# EAGLE design SX-Belegt2.10 (EAGLE 7.7.0)
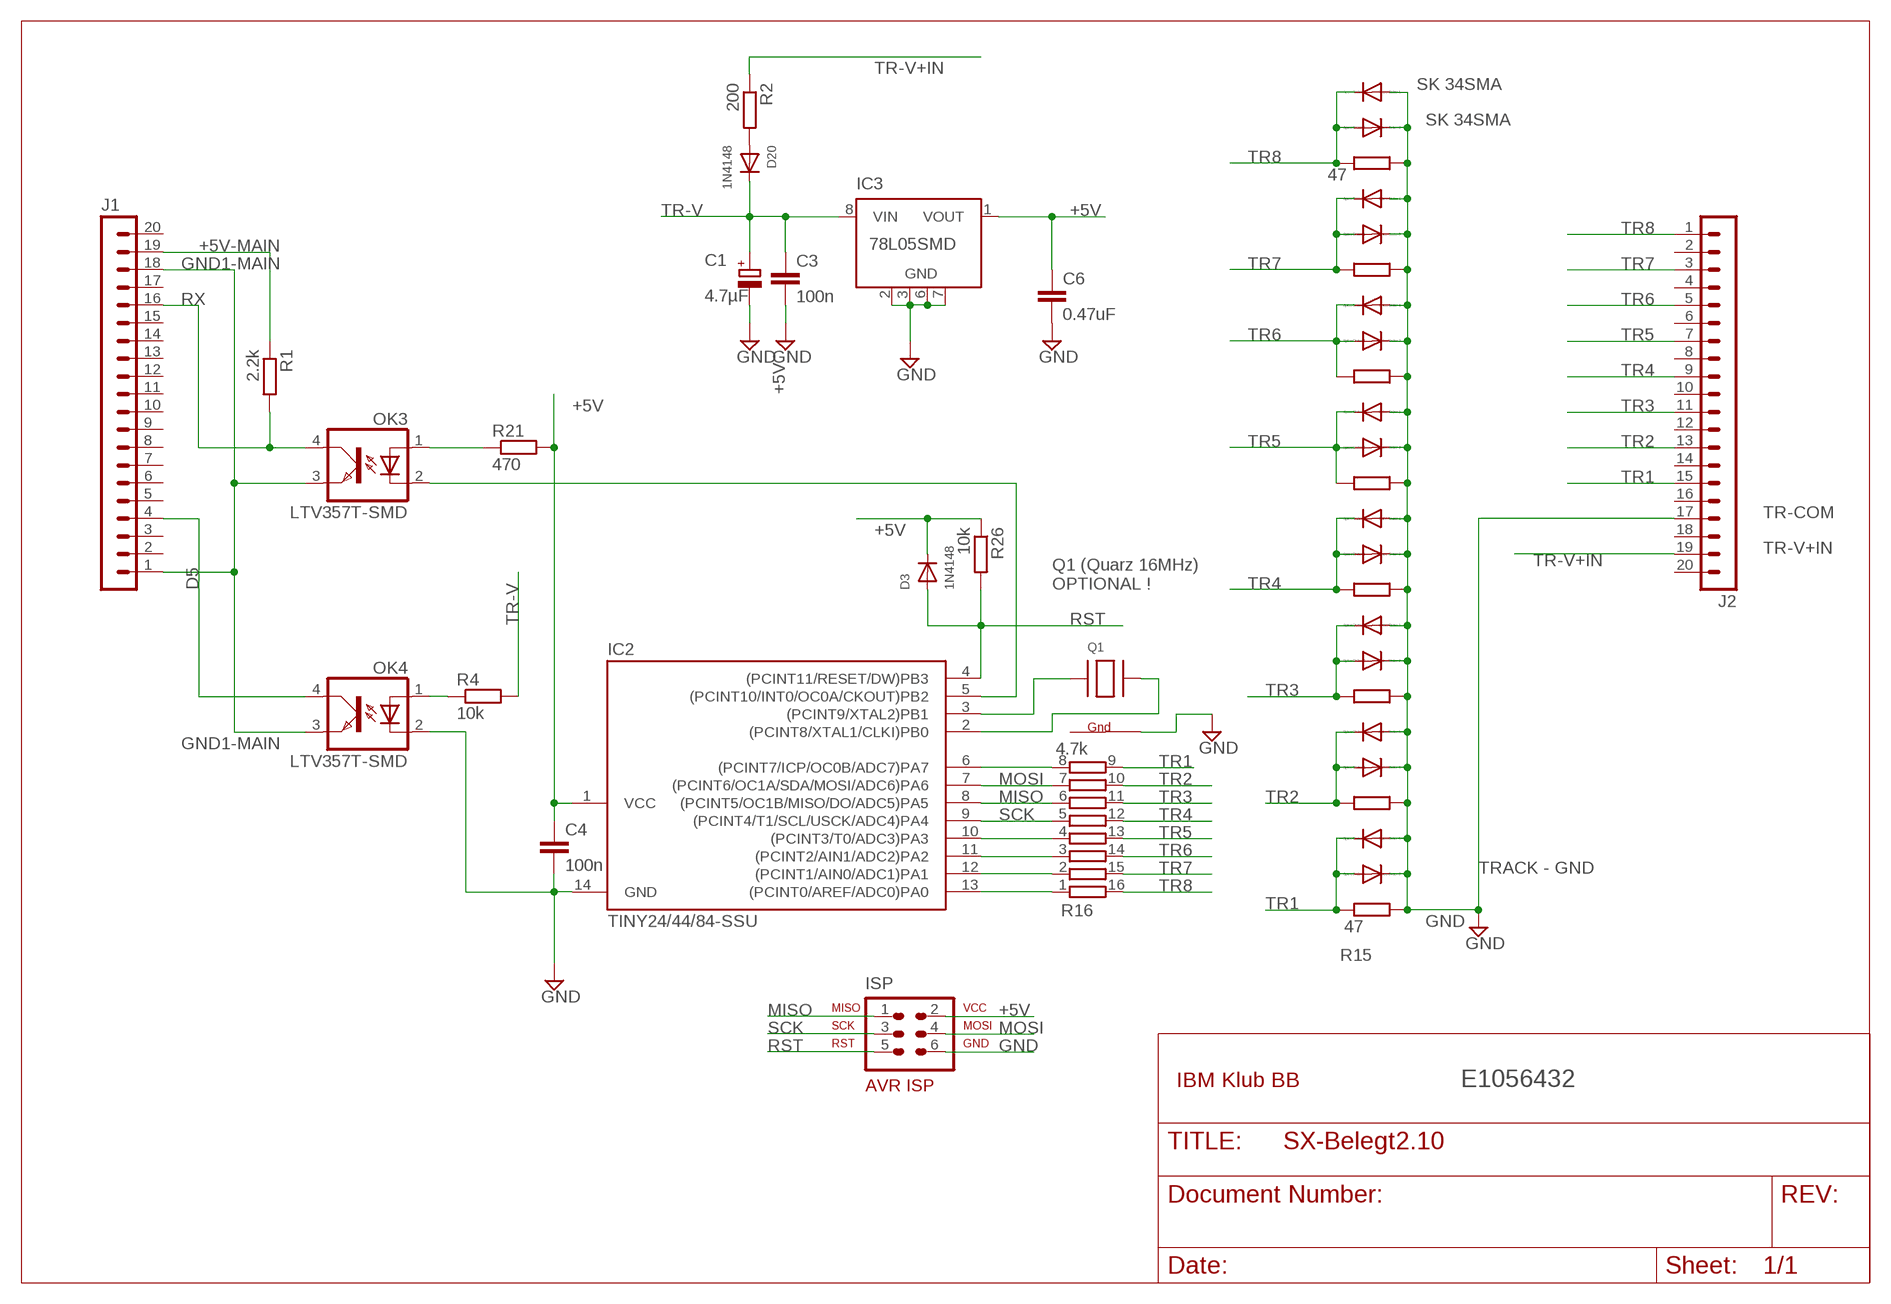
[diagram p0: schematic, sheet 1]

## Parts
C1  4.7µF  CPOL-EUSMCD  [SMC_D]
C3  100n  C-EUC0805K  [C0805K]
C4  100n  C-EUC0805K  [C0805K]
C6  0.47uF  C-EUC1206  [C1206]
D1  SK 34SMA  DIODE-DO-214AC  [DO-214AC]
D2  SK 34SMA  DIODE-DO-214AC  [DO-214AC]
D3  1N4148  DIODESOD-323F  [SOD-323F]
D4  SK 34SMA  DIODE-DO-214AC  [DO-214AC]
D5  SK 34SMA  DIODE-DO-214AC  [DO-214AC]
D6  SK 34SMA  DIODE-DO-214AC  [DO-214AC]
D7  SK 34SMA  DIODE-DO-214AC  [DO-214AC]
D9  SK 34SMA  DIODE-DO-214AC  [DO-214AC]
D10  SK 34SMA  DIODE-DO-214AC  [DO-214AC]
D11  SK 34SMA  DIODE-DO-214AC  [DO-214AC]
D12  SK 34SMA  DIODE-DO-214AC  [DO-214AC]
D13  SK 34SMA  DIODE-DO-214AC  [DO-214AC]
D15  SK 34SMA  DIODE-DO-214AC  [DO-214AC]
D16  SK 34SMA  DIODE-DO-214AC  [DO-214AC]
D17  SK 34SMA  DIODE-DO-214AC  [DO-214AC]
D18  SK 34SMA  DIODE-DO-214AC  [DO-214AC]
D19  SK 34SMA  DIODE-DO-214AC  [DO-214AC]
D20  1N4148  DIODESOD-323F  [SOD-323F]
IC2  TINY24/44/84-SSU  [SOIC14]
IC3  78L05SMD  [SO08]
ISP  AVR-ISP-2  AVR-ISP-6VERT  [AVR-ISP-6]
J1  MA20-1  [MA20-1]
J2  MA20-1  [MA20-1]
OK3  LTV357T-SMD  LTV816S  [SMD4]
OK4  LTV357T-SMD  LTV816S  [SMD4]
Q1  XTAL-4-3225  [NX3225]
R1  2.2k  R-EU_R0805W  [R0805W]
R2  200  R-EU_R0805W  [R0805W]
R4  10k  R-EU_R0805W  [R0805W]
R5  47  R-EU_M0805  [M0805]
R6  47  R-EU_M0805  [M0805]
R7  47  R-EU_M0805  [M0805]
R11  47  R-EU_M0805  [M0805]
R12  47  R-EU_M0805  [M0805]
R13  47  R-EU_M0805  [M0805]
R14  47  R-EU_M0805  [M0805]
R15  47  R-EU_M0805  [M0805]
R16  4.7k  4816P-T01  [4816P]
R21  470  R-EU_R0805W  [R0805W]
R26  10k  R-EU_R0805W  [R0805W]

## Nets
+5V: C4.1 C6.1 D3.C IC2.1(VCC) IC3.1(VOUT) ISP.2 R21.2 R26.1
+5V-MAIN: J1.19 R1.1
D5: J1.4 OK4.4(COL)
GND: C1.- C3.2 C4.2 C6.2 D1.A D2.C D4.A D5.C D6.A D7.C D9.A D10.A D11.A D12.A D13.A D15.C D16.C D17.C D18.C D19.C IC2.14(GND) IC3.2(GND) IC3.3(GND) IC3.6(GND) IC3.7(GND) ISP.6 J2.17 OK4.2(C) Q1.2(G2) R5.1 R6.1 R7.1 R11.1 R12.1 R13.1 R14.1 R15.1
GND1-MAIN: J1.1 J1.18 OK3.3(EMIT) OK4.3(EMIT)
MISO: IC2.8((PCINT5/OC1B/MISO/DO/ADC5)PA5) ISP.1 R16.6
MOSI: IC2.7((PCINT6/OC1A/SDA/MOSI/ADC6)PA6) ISP.4 R16.7
N$1: IC2.6((PCINT7/ICP/OC0B/ADC7)PA7) R16.8
N$2: D20.A R2.2
N$3: OK4.1(A) R4.1
N$5: OK3.1(A) R21.1
N$6: IC2.3((PCINT9/XTAL2)PB1) Q1.1(X1)
N$7: IC2.2((PCINT8/XTAL1/CLKI)PB0) Q1.3(X2)
N$10: IC2.13((PCINT0/AREF/ADC0)PA0) R16.1
N$14: IC2.5((PCINT10/INT0/OC0A/CKOUT)PB2) OK3.2(C)
N$15: IC2.12((PCINT1/AIN0/ADC1)PA1) R16.2
N$20: IC2.10((PCINT3/T0/ADC3)PA3) R16.4
N$27: IC2.11((PCINT2/AIN1/ADC2)PA2) R16.3
RST: D3.A IC2.4((PCINT11/RESET/DW)PB3) ISP.5 R26.2
RX: J1.16 OK3.4(COL) R1.2
SCK: IC2.9((PCINT4/T1/SCL/USCK/ADC4)PA4) ISP.3 R16.5
TR1: D13.C D19.A J2.15 R15.2 R16.9
TR2: D12.C D18.A J2.13 R14.2 R16.10
TR3: D11.C D17.A J2.11 R13.2 R16.11
TR4: D10.C D16.A J2.9 R12.2 R16.12
TR5: D9.C D15.A J2.7 R5.2 R16.13
TR6: D6.C D7.A J2.5 R11.2 R16.14
TR7: D4.C D5.A J2.3 R7.2 R16.15
TR8: D1.C D2.A J2.1 R6.2 R16.16
TR-V: C1.+ C3.1 D20.C IC3.8(VIN) R4.2
TR-V+IN: J2.19 R2.1
Unconnected: IC3.4(NC) IC3.5(NC) J1.2 J1.3 J1.5 J1.6 J1.7 J1.8 J1.9 J1.10 J1.11 J1.12 J1.13 J1.14 J1.15 J1.17 J1.20 J2.2 J2.4 J2.6 J2.8 J2.10 J2.12 J2.14 J2.16 J2.18 J2.20

## Notes on the sheet
- TR-COM
- TR-V+IN
- Q1 (Quarz 16MHz) 
  OPTIONAL !
- TRACK - GND
- IBM Klub BB | E1056432

## Power pins joined to a net without a drawn wire
G1: Q1.4(G1)

## Library data of the parts
C1 = rcl:CPOL-EU: POLARIZED CAPACITOR, European symbol
C3 C4 C6 = rcl:C-EU: CAPACITOR, European symbol
D1 D2 D4-D7 D9-D13 D15-D19 = diode:DIODE-: DIODE
D3 D20 = adafruit:DIODE: Diode SMADIODE - SMA Surface Mount Package 20V 1A Schottky Diode Digikey: 641-1014-6-ND DO-1N4148 - Through Hole Small Current Diode SOD-123 20V 1 A (.5mV Vf) Schottky Diode - Digikey: MBRX120TPMSCT-ND SOD-323 10V 570mA (.38mV Vf, 3ns) Schottky Diode - Digikey: ZLLS410CT-ND SOD-523 30V 30mA Schottky Diode (RB751S-40TE61) - Digikey: RB751S-40TE61CT-ND SOT23-R/W - SOT23 Package (R = Solder Paste/Reflow Ovens, W = Hand-Soldering) BAT54Film 40V 300mA - Digikey: 497-7162-1-ND
IC2 = avr-4:TINY24/44/84
IC3 = linear:78L*SMD: Positive VOLTAGE REGULATOR
ISP = avr-7:AVR-ISP-6: AVR ISP-6 Serial Programming Header
J1 J2 = con-lstb:MA20-1: PIN HEADER; OC_FARNELL: unknown; OC_NEWARK: unknown
OK3 OK4 = optocoupler:LTV816: OPTO COUPLER Source: LITEON, LTV816.pdf; OC_FARNELL: unknown; OC_NEWARK: unknown
Q1 = adafruit:XTAL-4: Classic 4-pin 3.2 x 2.5mm crystal
R1 R2 R4-R7 R11-R15 R21 R26 = rcl:R-EU_: RESISTOR, European symbol
R16 = resistor-bourns:4816P-T01: BOURNS RESISTOR NETWORK; MF: BOURNS, INC.; MPN: 4816P-T01-684LF; OC_FARNELL: 9357483; OC_NEWARK: 33K0707

## Net classes
0 default: width 0.203 mm

## Board
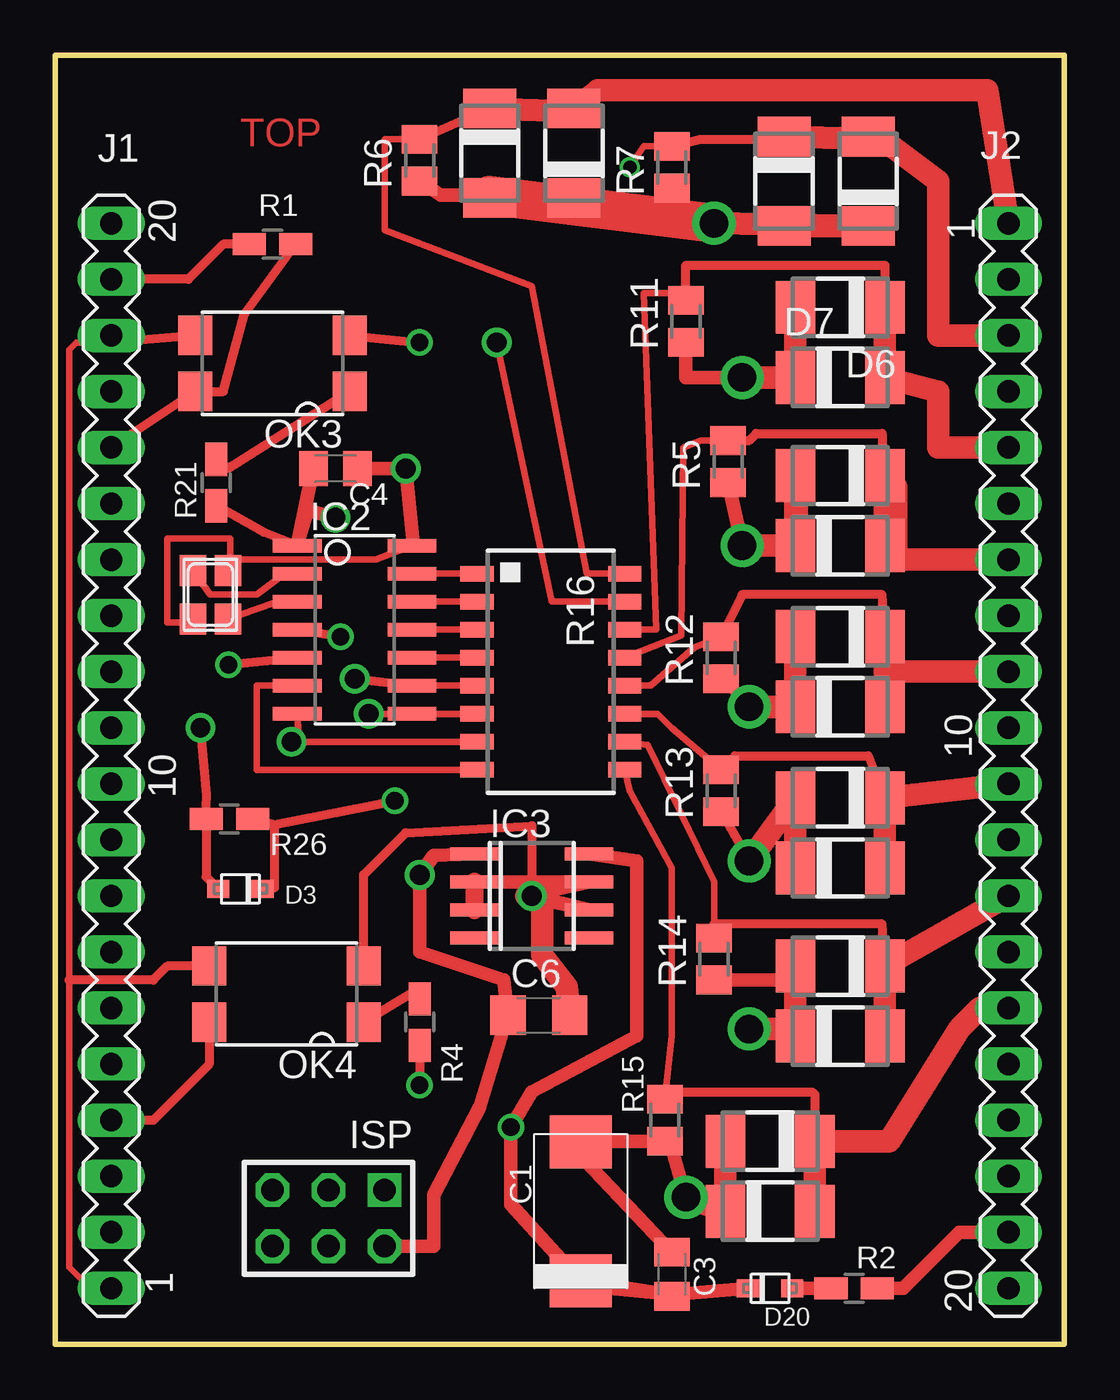
[diagram p1: board, top side]
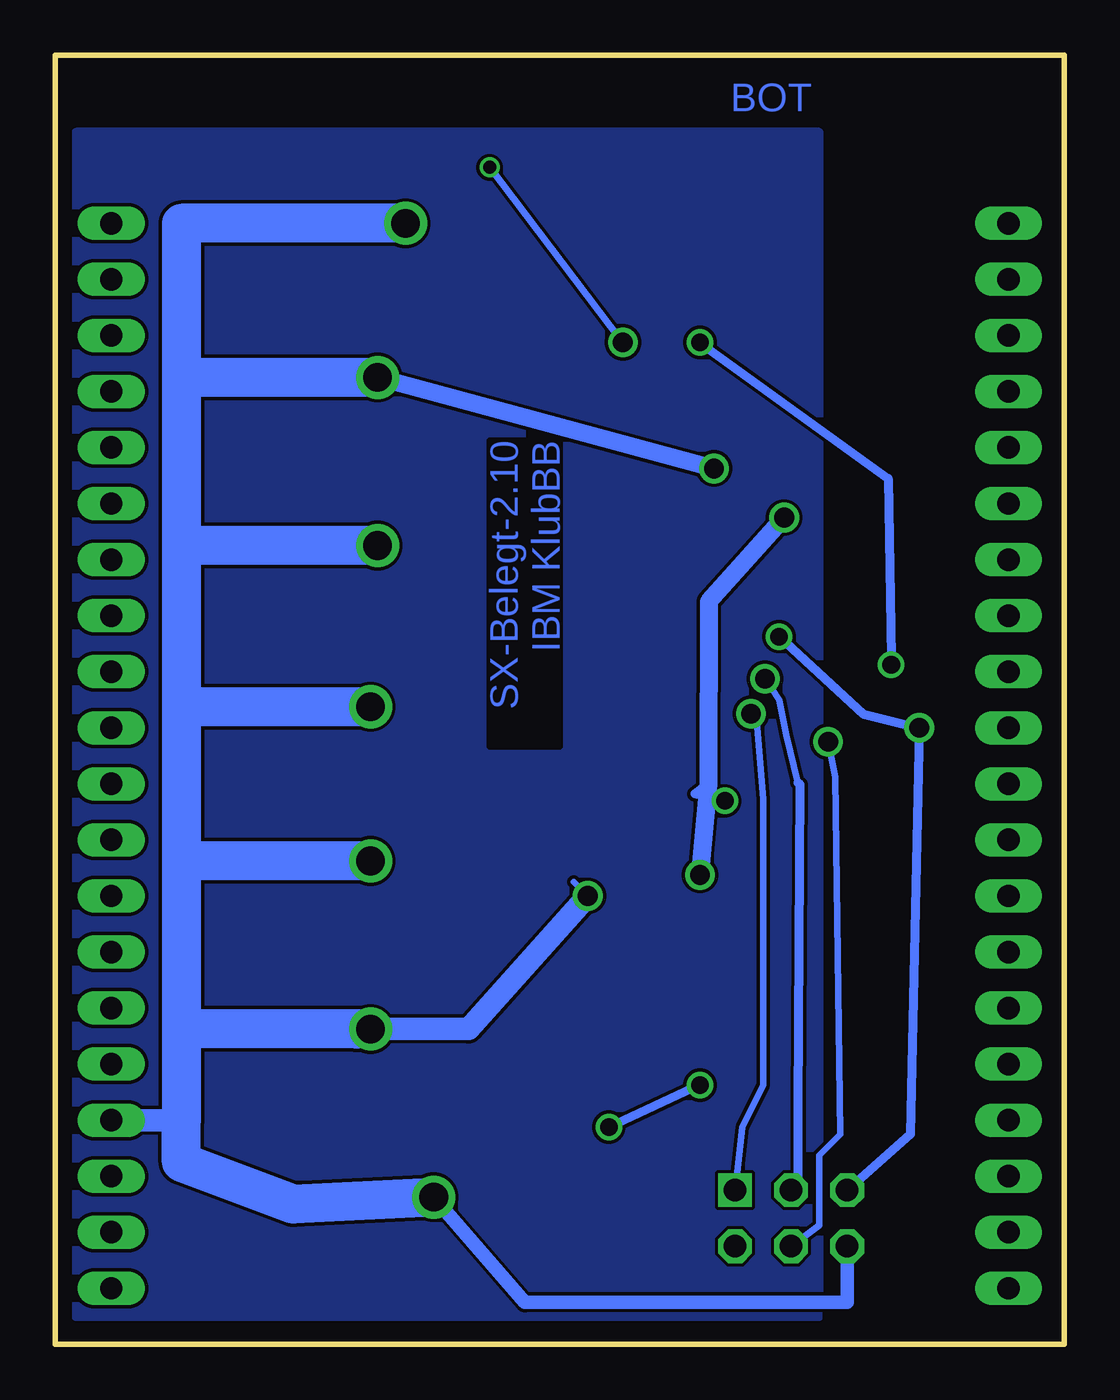
[diagram p2: board, bottom side, seen from below]

Size 45.72 x 58.42 mm. Coordinates in mm from the lower left corner, seen from the top.
Outline: 0,0 45.72,0 45.72,58.42 0,58.42 0,0
Copper layers (1*16): Top 0.018mm / dielectric 1.55mm / Bottom 0.018mm
Design rules "eC_2Layer_PClass6_BaseCopperO18_eCDefault": minimum track width 0.15mm, minimum drill 0.35mm, track to track 0.15mm, track to pad 0.15mm, pad to pad 0.15mm, via to via 0.15mm, smd to smd 0mil, copper to edge 0.25mm, drill to drill 0.35mm, minimum pad ring 0.175mm, minimum via ring 0.125mm, stop-mask expansion 0mil, vias tented up to drill 0.45mm, thermal gap 0.2mm

### Footprints (pad centres in the part's own frame; a part is rotated, then mirrored left to right if it is on the bottom)
SMC_D = smd 2.4 x 2.8: + -3.15,0; - 3.15,0
C0805K = smd 1.3 x 1.6: 1 -1,0; 2 1,0
C1206 = smd 1.6 x 1.8: 1 -1.4,0; 2 1.4,0
DO-214AC = smd 1.8 x 2.4: A 2.025,0; C -2.025,0
SOD-323F = smd 1 x 0.8: A -1,0; C 1,0
SOIC14 = smd 0.61 x 2.21: 1 -3.81,-2.603; 2 -2.54,-2.603; 3 -1.27,-2.603; 4 0,-2.603; 5 1.27,-2.603; 6 2.54,-2.603; 7 3.81,-2.603; 8 3.81,2.603; 9 2.54,2.603; 10 1.27,2.603; 11 0,2.603; 12 -1.27,2.603; 13 -2.54,2.603; 14 -3.81,2.603
SO08 = smd 0.6 x 2.2: 1 -1.905,-2.6; 2 -0.635,-2.6; 3 0.635,-2.6; 4 1.905,-2.6; 5 1.905,2.6; 6 0.635,2.6; 7 -0.635,2.6; 8 -1.905,2.6
AVR-ISP-6 = drill 1.016 square: 1 -2.54,-1.27 | drill 1.016 octagon: 2 -2.54,1.27; 3 0,-1.27; 4 0,1.27; 5 2.54,-1.27; 6 2.54,1.27
MA20-1 = drill 1.016 long: 1 -24.13,0; 2 -21.59,0; 3 -19.05,0; 4 -16.51,0; 5 -13.97,0; 6 -11.43,0; 7 -8.89,0; 8 -6.35,0; 9 -3.81,0; 10 -1.27,0; 11 1.27,0; 12 3.81,0; 13 6.35,0; 14 8.89,0; 15 11.43,0; 16 13.97,0; 17 16.51,0; 18 19.05,0; 19 21.59,0; 20 24.13,0
SMD4 = smd 1.78 x 1.55: 1 -1.27,-3.5; 2 1.27,-3.5; 3 1.27,3.5; 4 -1.27,3.5
NX3225 = smd 1.4 x 1.2: 1 -1.1,-0.8; 2 1.1,-0.8; 3 1.1,0.8; 4 -1.1,0.8
R0805W = smd 1.5 x 1: 1 -1.052,0; 2 1.052,0
M0805 = smd 1.3 x 1.6: 1 -0.95,0; 2 0.95,0
4816P = smd 0.7 x 1.5: 1 -4.445,-3.346; 2 -3.175,-3.346; 3 -1.905,-3.346; 4 -0.635,-3.346; 5 0.635,-3.346; 6 1.905,-3.346; 7 3.175,-3.346; 8 4.445,-3.346; 9 4.445,3.346; 10 3.175,3.346; 11 1.905,3.346; 12 0.635,3.346; 13 -0.635,3.346; 14 -1.905,3.346; 15 -3.175,3.346; 16 -4.445,3.346

### Placement (x,y rotation side)
C1  23.81,6.03 90 top
C3  27.94,3.17 90 top
C4  12.7,39.69 0 top
C6  21.91,14.92 0 top
D1  19.68,53.98 270 top
D2  23.5,53.98 90 top
D3  8.39,20.64 0 top
D4  33.02,52.7 270 top
D5  36.83,52.7 90 top
D6  35.56,46.99 180 top
D7  35.56,43.81 0 top
D9  35.56,39.37 180 top
D10  35.56,32.07 180 top
D11  35.56,24.77 180 top
D12  35.56,17.14 180 top
D13  32.38,9.21 180 top
D15  35.56,36.2 0 top
D16  35.56,28.89 0 top
D17  35.56,21.59 0 top
D18  35.56,13.97 0 top
D19  32.38,6.03 0 top
D20  32.38,2.54 180 top
IC2  13.56,32.38 270 top
IC3  21.59,20.32 270 top
ISP  12.38,5.71 180 top
J1  2.54,26.67 90 top
J2  43.18,26.67 270 top
OK3  9.84,44.45 90 top
OK4  10.48,15.88 90 top
Q1  7.03,33.97 90 top
R1  9.84,49.85 0 top
R2  36.2,2.54 180 top
R4  16.51,14.61 270 top
R5  30.48,40.01 90 top
R6  16.51,53.66 90 top
R7  27.94,53.34 90 top
R11  28.57,46.35 90 top
R12  30.16,31.11 90 top
R13  30.16,25.08 90 top
R14  29.84,17.46 90 top
R15  27.62,10.16 90 top
R16  22.45,30.48 270 top
R21  7.3,39.05 270 top
R26  7.89,23.81 180 top

### Tracks (layer width: path | path; a pad name or v marks a point on that pad's centre or on a via)
+5V  (via drill 0.8, 0.9)
  Top 0.406: C4.1 11.7,39.7 | IC2.1 9.46,36.79 R21.2 | R26.1 9.94,23.55 | D3.C 9.94,20.69 9.94,23.55 | 9.94,23.55 v15.38,24.63
  Top 0.61: 11.7,39.7 IC2.1 11.43,37.78 v12.7,37.47 | IC3.1 17.14,22.16 v16.51,21.27 16.51,17.78 20.32,16.51 C6.1 19.24,10.77 17.14,6.77 17.14,4.45 ISP.2
  Bottom 0.406: v15.38,24.63 16.74,24.95 16.13,25.43
  Bottom 0.813: v12.7,37.47 16.11,33.66 16.13,25.43 v16.51,21.27
+5V-MAIN
  Top 0.406: R1.1 7.62,49.85 6.03,48.26 J1.19
D5
  Top 0.406: OK4.4 6.98,12.69 4.45,10.16 J1.4
GND  (via drill 0.9, 1.3)
  Top 0.305: 6.35,33.02 6.35,32.7 5.08,32.7 5.08,36.51 7.94,36.51 7.94,35.56 14.52,35.56 IC2.14
  Top 0.406: R12.1 v31.43,28.89 | R13.1 v31.43,21.91 | OK4.2 13.98,21.28 15.88,23.18 21.59,23.5 21.59,20.95 | D12.A 33.66,17.14 33.66,16.83 | Q1.2 7.94,35.56
  Top 0.61: 19.68,52.07 17.46,52.07 R6.1 | R7.1 27.94,51.44 v29.84,50.8 | R11.1 28.57,43.81 v31.11,43.81 | IC2.14 16.19,36.51 v15.88,39.69 C4.2 | R5.1 v31.11,36.2 | R14.1 33.66,16.51 33.66,16.83 | C3.2 23.2,9.18 | 23.2,9.18 C1.- | 23.2,9.18 23.23,9.21 R15.1 27.94,8.89 v28.57,6.67 | IC3.2 21.59,20.95 IC3.7 21.33,20.32 IC3.6 v21.59,20.32
  Top 0.813: IC3.2 IC3.3
  Top 1.016: D1.A D2.C 19.68,52.07 | D4.A D5.C v29.84,50.8 | D6.A D7.C v31.11,43.81 | D15.C D9.A 33.66,36.2 v31.11,36.2 | D10.A D16.C v31.43,28.89 | D17.C D11.A v31.43,21.91 | 33.66,16.83 33.53,16.07 D18.C 33.22,14.29 v31.43,14.29 | D13.A D19.C v28.57,6.67 | C6.2 23.18,16.19 22.07,17.62 22.07,20.48 v21.59,20.32 21.33,20.32
  Top 1.778: 19.68,52.07 v29.84,50.8
  Bottom 0.305: 22.23,20.95 v21.59,20.32
  Bottom 0.61: ISP.6 9.84,1.91 24.45,1.91 v28.57,6.67
  Bottom 0.813: v15.88,39.69 v31.11,43.81
  Bottom 1.016: 40.01,10.16 J2.17 | v21.59,20.32 26.99,14.29 32.07,14.29
  Bottom 1.778: 40.01,43.81 40.01,50.8 v29.84,50.8 | 40.01,43.81 40.01,36.2 | 40.01,36.2 40.01,28.89 | 40.01,28.89 40.01,21.91 | 40.01,21.91 40.01,14.29 | 40.01,14.29 40.01,10.16 40.01,8.26 34.92,6.35 v28.57,6.67 | v31.11,43.81 40.01,43.81 | v31.11,36.2 40.01,36.2 | v31.43,28.89 40.01,28.89 | v31.43,21.91 40.01,21.91 | v31.43,14.29 32.07,14.29 40.01,14.29
GND1-MAIN
  Top 0.305: J1.1 1.59,2.54 0.64,3.49 0.64,16.51 0.64,45.09 0.95,45.4 2.22,45.4 J1.18
  Top 0.406: 5.71,45.72 OK3.3 2.54,45.4 J1.18 | OK4.3 5.08,17.14 4.45,16.51 0.64,16.51
MISO  (via drill 0.9)
  Top 0.305: IC2.8 R16.6 v14.2,28.57
  Bottom 0.305: ISP.1 14.61,9.84 13.65,11.75 13.65,24.7 13.95,28.26 v14.2,28.57
MOSI  (via drill 0.9)
  Top 0.305: R16.7 11.03,27.3 IC2.7 11.03,27.69 v10.71,27.3
  Bottom 0.305: ISP.4 11.11,5.4 11.11,8.57 10.16,9.53 10.39,25.72 v10.71,27.3
N$1
  Top 0.305: R16.8 9.12,26.04 9.12,29.84 IC2.6
N$2
  Top 0.61: R2.2 D20.A
N$3
  Top 0.406: OK4.1 16.09,15.88 R4.1
N$4
  pour Bottom: 44.77,54.93 44.77,1.27 11.11,1.27 11.11,54.93 11.43,54.93
N$5
  Top 0.406: OK3.1 7.84,39.69 R21.1
N$6
  Top 0.305: Q1.1 10.07,33.66 IC2.3
N$7
  Top 0.305: Q1.3 7.03,33.97 9.12,33.97 10.39,34.92 IC2.2
N$10
  Top 0.305: R16.1 IC2.13
N$14  (via drill 0.8)
  Top 0.406: OK3.2 v16.51,45.4 | v7.85,30.8 IC2.5
  Bottom 0.406: v16.51,45.4 7.99,39.23 7.85,31.11 v7.85,30.8
N$15
  Top 0.305: R16.2 IC2.12
N$20
  Top 0.305: R16.4 IC2.10
N$27
  Top 0.305: R16.3 IC2.11
RST  (via drill 0.8 pad 0.61, 0.9)
  Top 0.406: v6.58,27.94 6.85,24.9 6.8,23.81 R26.2 6.84,21.19 D3.A | IC2.4 v12.93,32.07
  Bottom 0.406: ISP.5 6.99,9.53 v6.58,27.94 9.12,28.57 v12.93,32.07
RX
  Top 0.406: J1.16 OK3.4 7.62,43.18 8.57,46.67 R1.2
SCK  (via drill 0.9)
  Top 0.305: R16.5 IC2.9
  Top 0.406: v13.56,30.16 IC2.9
  Bottom 0.305: 11.98,25.08 12.07,25.46 12.61,27.62 12.93,29.21 v13.56,30.16
  Bottom 0.406: ISP.3 12.06,6.99 12.06,10.79 11.98,25.36 12.07,25.46
TR1
  Top 0.305: R16.9 26.04,25.08 27.94,21.59 27.94,13.97 R15.2
  Top 0.406: R15.2 27.94,11.43 34.29,11.43 34.41,11.31 D13.C
  Top 1.016: J2.15 41.91,15.24 40.96,14.29 37.78,9.21 D13.C D19.A
TR2
  Top 0.305: R14.2 29.84,20.95 26.85,27.17 R16.10
  Top 0.406: D12.C 37.47,19.05 29.84,19.05 R14.2
  Top 1.016: J2.13 D12.C D18.A
TR3
  Top 0.305: R16.11 27.3,28.57 27.94,27.94 R13.2
  Top 0.406: R13.2 30.8,26.67 36.83,26.67 D11.C
  Top 1.016: J2.11 D11.C D17.A
TR4
  Top 0.305: R12.2 28.94,31.57 26.99,29.84 R16.12
  Top 0.406: D10.C 37.47,33.97 31.11,33.97 R12.2
  Top 1.016: J2.9 37.78,30.48 D16.A D10.C
TR5
  Top 0.305: R5.2 29.25,40.95 28.44,40.64 28.35,32.12 R16.13
  Top 0.406: R5.2 31.43,40.95 31.75,41.27 37.47,41.27 37.47,39.49 D9.C
  Top 1.016: J2.7 38.1,35.56 38.1,38.85 D9.C D15.A
TR6
  Top 0.305: R16.14 27.22,32.38 26.67,47.62 28.57,47.62 R11.2
  Top 0.406: R11.2 28.57,48.9 37.59,48.9 D7.A
  Top 1.016: J2.5 40.01,40.64 40.01,43.18 D7.A D6.C
TR7  (via drill 0.6, 0.9)
  Top 0.305: R16.15 22.5,33.66 v20,45.4 | v26.04,53.34 26.67,54.29 | 27.62,54.29 26.67,54.29 | 26.67,54.29 R7.2
  Top 0.406: R7.2 29.21,54.61 37.47,54.61
  Top 1.016: J2.3 40.01,45.72 40.01,52.7 37.47,54.61 | 37.47,54.61 D4.C | 37.47,54.61 D5.A
  Bottom 0.305: v20,45.4 v26.04,53.34
TR8
  Top 0.305: R16.16 24.09,34.92 21.59,47.94 14.92,50.48 14.92,54.61 R6.2
  Top 0.406: R6.2 19.37,55.88 23.3,55.88
  Top 1.016: J2.1 42.23,56.83 24.57,56.83 D2.A 23.3,55.88 D1.C
TR-V  (via drill 0.8)
  Top 0.406: 24.03,2.44 24.46,2.87 | R4.2 v16.51,11.75
  Top 0.61: D20.C 27.87,2.25 C1.+ | C1.+ 24.46,2.87 25.11,2.86 25.08,2.54 27.89,2.27 C3.1 | C1.+ 23.81,2.86 20.64,6.35 v20.64,9.84 21.59,11.43 26.35,13.97 26.35,21.91 IC3.8
  Bottom 0.406: v16.51,11.75 v20.64,9.84
TR-V+IN
  Top 0.61: J2.19 40.96,5.08 38.42,2.54 R2.1

### Text on the board
Top: TOP
Bottom: BOT | SX-Belegt-2.10 / IBM KlubBB
tDocu: Mistake in brd-file: / connect ground plane / to GND by HAND !